# EAGLE schematic vu_esquema (EAGLE 7.2.0)
CDESIGNER: Apellido, Nombre; CNAME: VUMETRO CON ARDUINO; CREVISION: 1.0; CSCHO: EEST N°2
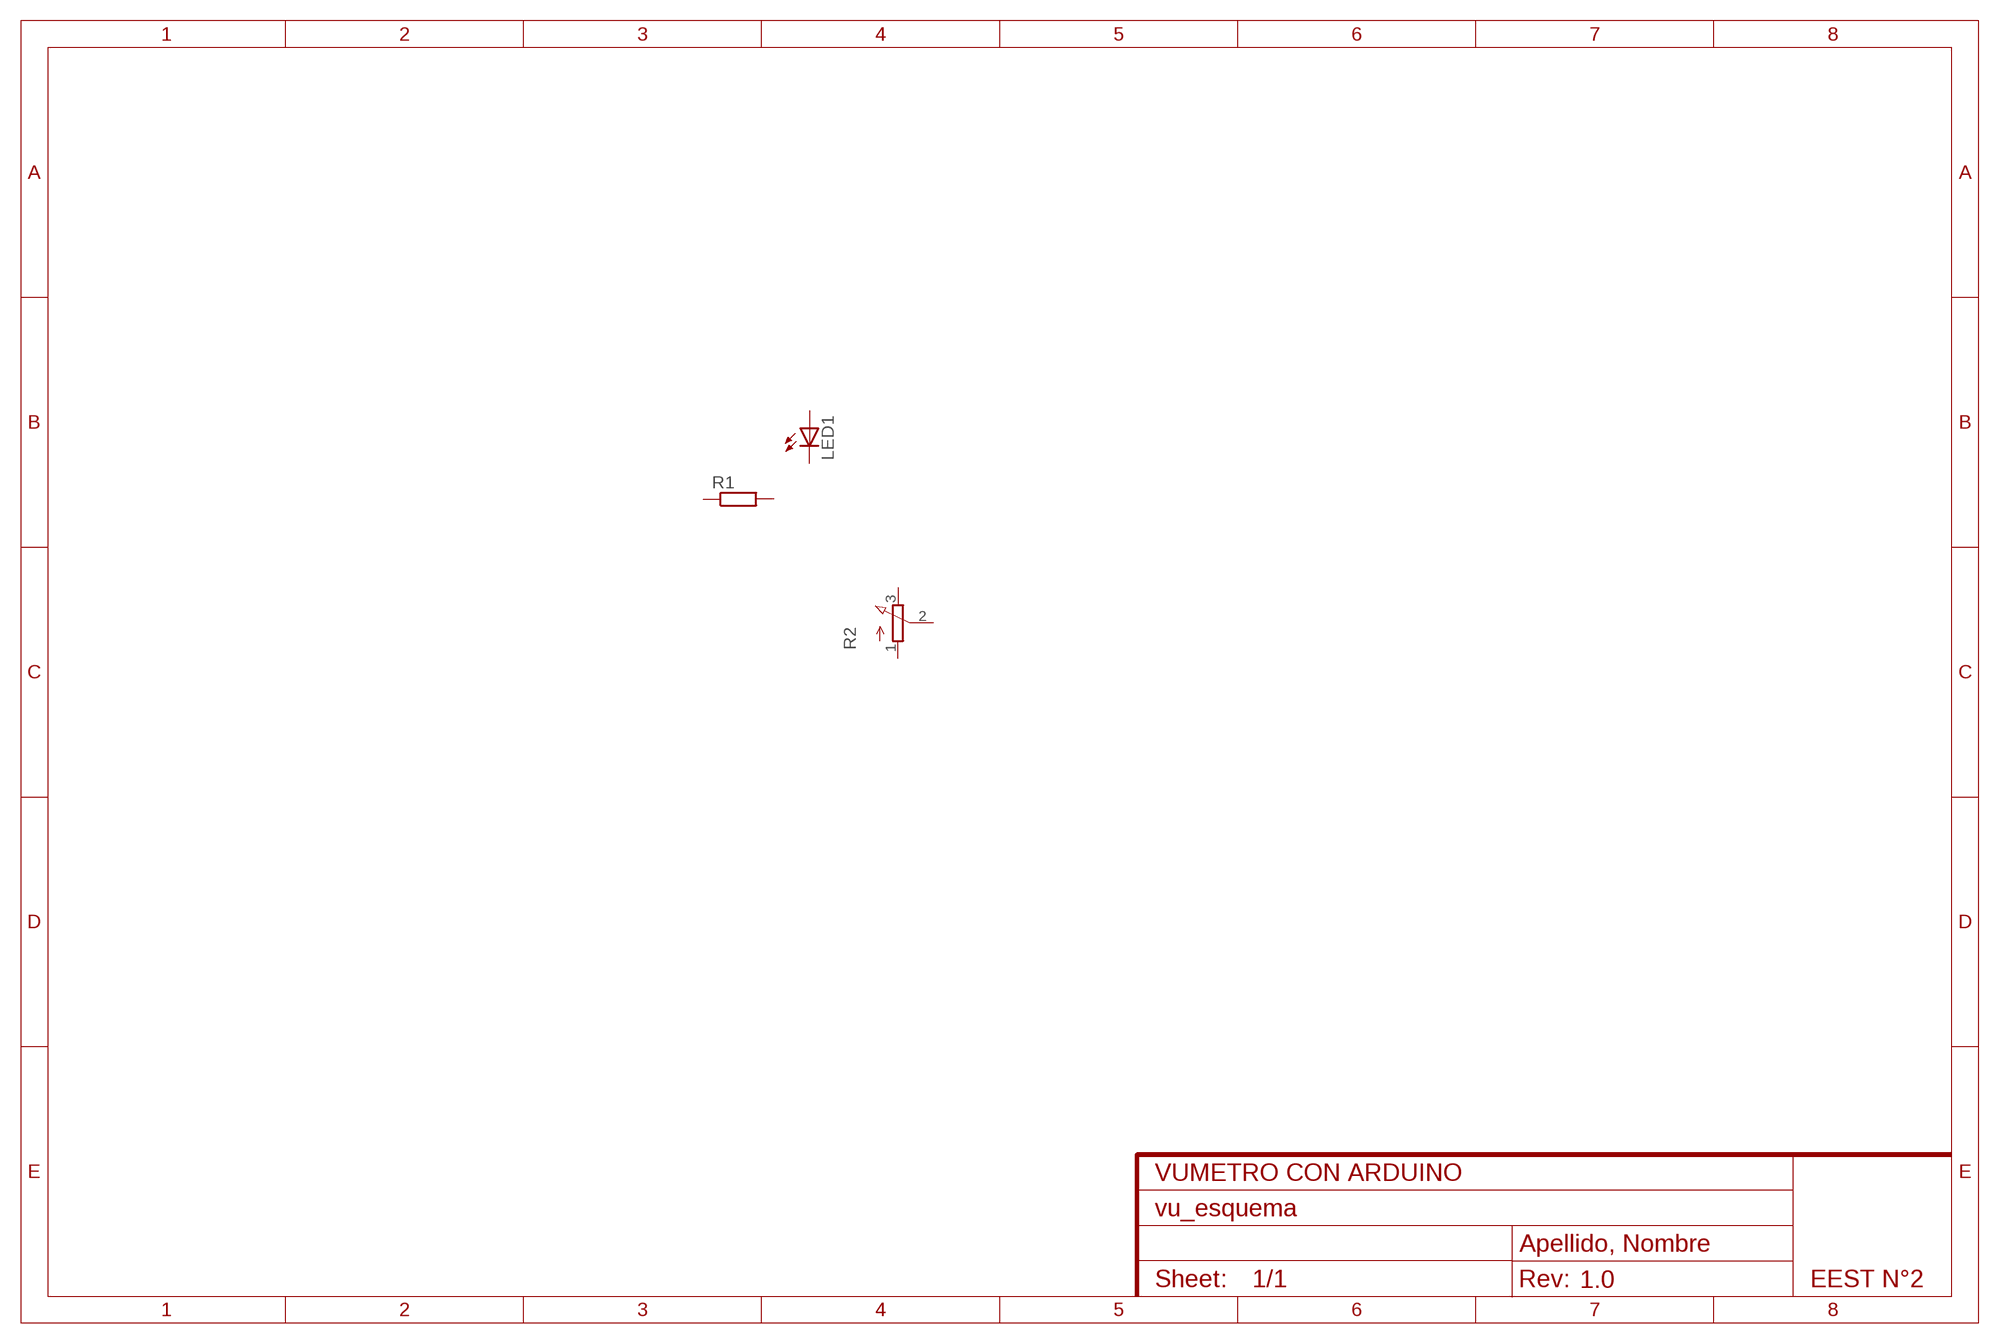
[diagram p0: schematic, sheet 1]

## Parts
LED1  LED5MM  [LED_5MM]
R1  RESISTOR-EU0204/7  [0204/7]
R2  3RP/1610N  [3RP/1610N]
Unconnected: LED1.A LED1.K(C) R1.1 R1.2 R2.1(A) R2.2(S) R2.3(E)

## Library data of the parts
LED1 = treser_lib:LED: LEDs
R1 = treser_lib:RESISTOR-EU: Resistor Simbolo europeo.
R2 = pot:3RP/1610N: 16mm Potentiometer one level Source: http://www.alphapotentiometers.net/html/16mm_pot_2.html